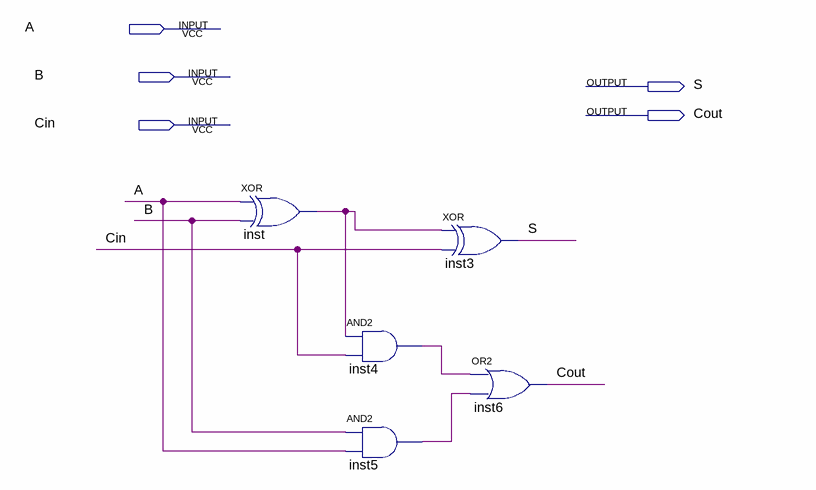
[diagram p0: schematic sheet]
// Quartus schematic g14_1bitAdder.bdf as structural Verilog: 5 symbols, 5 pins
module g14_1bitAdder (
  input  A,
  input  B,
  input  Cin,
  output S,
  output Cout
);

  wire inst4_out, inst5_out, inst_out;

  xor inst (inst_out, A, B);
  and inst4 (inst4_out, inst_out, Cin);
  and inst5 (inst5_out, B, A);
  xor inst3 (S, inst_out, Cin);
  or inst6 (Cout, inst4_out, inst5_out);
endmodule
